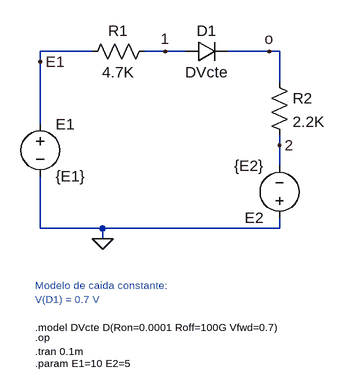
[diagram p0: schematic ejemplo5_caida-constante.asc]
ejemplo5_caida-constante.asc, the LTspice schematic file:
Version 4
SHEET 1 1376 680
WIRE -64 -80 -144 -80
WIRE 48 -80 16 -80
WIRE 80 -80 48 -80
WIRE 208 -80 144 -80
WIRE 224 -80 208 -80
WIRE -144 -64 -144 -80
WIRE 224 -32 224 -80
WIRE -144 32 -144 -64
WIRE 224 64 224 48
WIRE 224 96 224 64
WIRE -144 192 -144 112
WIRE -48 192 -144 192
WIRE 224 192 224 176
WIRE 224 192 -48 192
WIRE -48 208 -48 192
FLAG -48 208 0
FLAG 208 -80 o
FLAG -144 -64 E1
FLAG 48 -80 1
FLAG 224 64 2
SYMBOL diode 80 -64 R270
WINDOW 0 32 32 VTop 2
WINDOW 3 0 32 VBottom 2
SYMATTR InstName D1
SYMATTR Value DVcte
SYMBOL voltage -144 16 R0
WINDOW 123 0 0 Left 0
WINDOW 39 0 0 Left 0
SYMATTR InstName E1
SYMATTR Value {E1}
SYMBOL res -80 -64 R270
WINDOW 0 32 56 VTop 2
WINDOW 3 0 56 VBottom 2
SYMATTR InstName R1
SYMATTR Value 4.7K
SYMBOL res 208 -48 R0
SYMATTR InstName R2
SYMATTR Value 2.2K
SYMBOL voltage 224 192 R180
WINDOW 123 0 0 Left 0
WINDOW 39 0 0 Left 0
SYMATTR InstName E2
SYMATTR Value {E2}
TEXT -152 360 Left 1 !.op\n.tran 0.1m
TEXT -152 344 Left 1 !.model DVcte D(Ron=0.0001 Roff=100G Vfwd=0.7)
TEXT -152 280 Left 1 ;Modelo de caida constante:\nV(D1) = 0.7 V
TEXT -152 400 Left 1 !.param E1=10 E2=5

The netlist it stands for:
* ejemplo5_caida-constante.asc
D1 1 o DVcte
V§E1 E1 0 {E1}
R1 E1 1 4.7K
R2 o 2 2.2K
V§E2 0 2 {E2}
.model D D
.lib standard.dio
.op
.tran 0.1m
.model DVcte D(Ron=0.0001 Roff=100G Vfwd=0.7)
* Modelo de caida constante:
* V(D1) = 0.7 V
.param E1=10 E2=5
.backanno
.end